# Altium schematic sheet Moto Power Supply 4x12v 4x5v.SchDoc: ComponentName
size A4; SheetNumber: 1; SheetTotal: 1; Version: ver; Variant: Variant; Modification: Mod; Project: Project Name
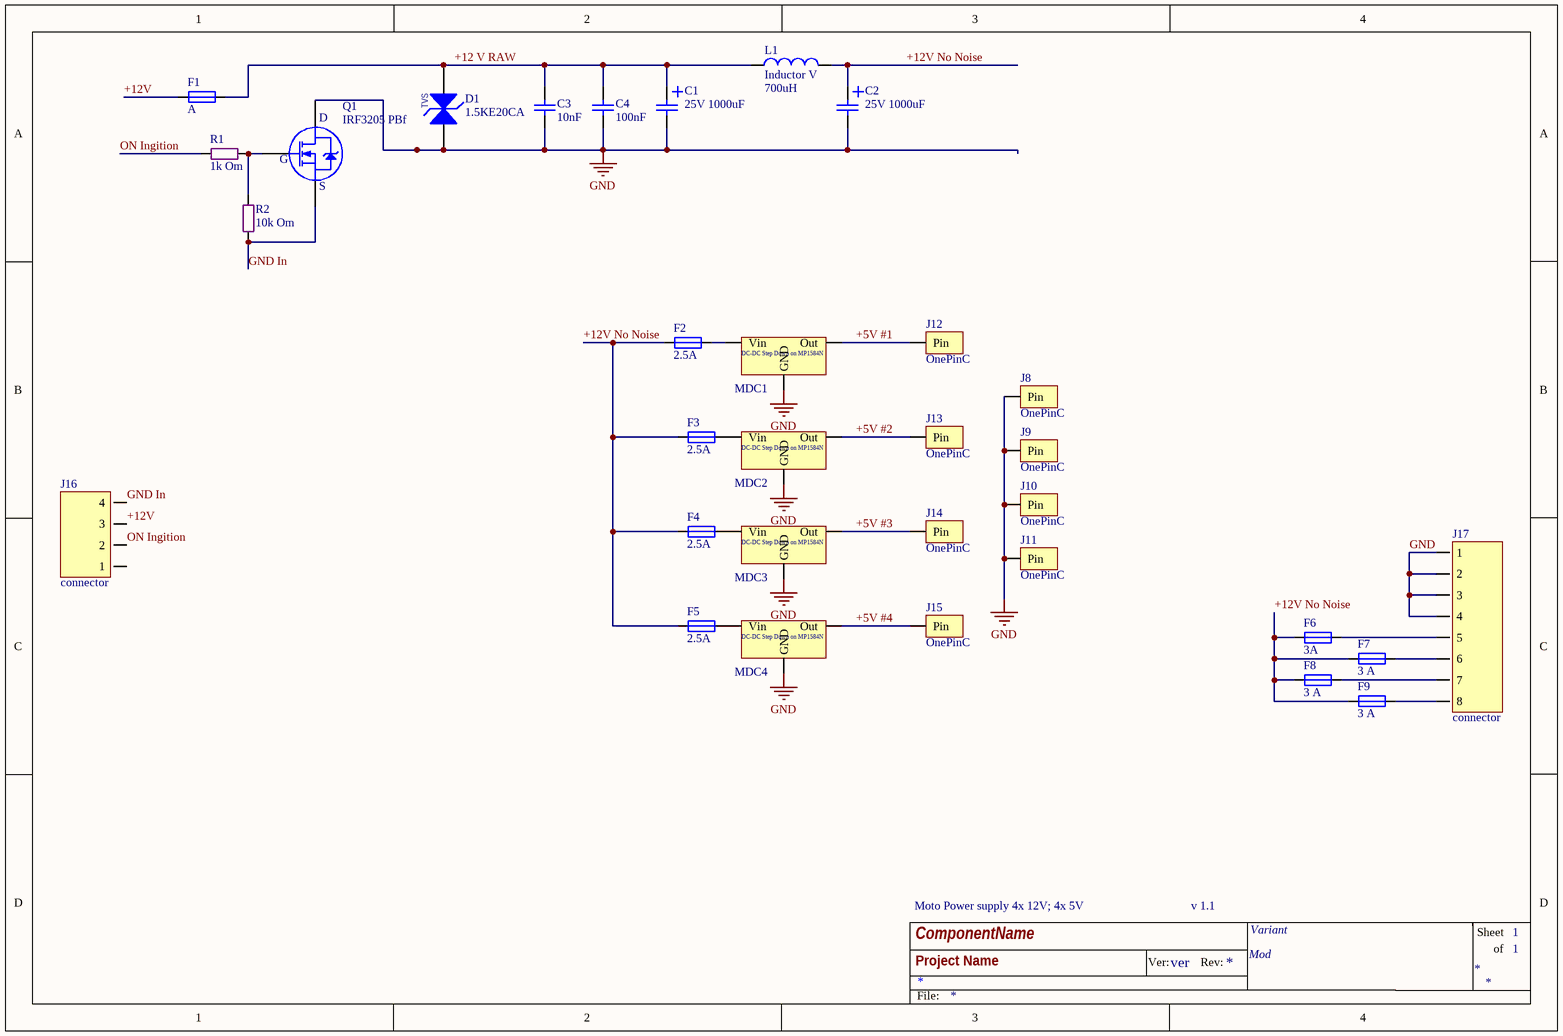
[diagram p0: Moto Power Supply 4x12v 4x5v.SchDoc]

## Parts
C1  25V 1000uF  [Cap E p5.08mm D10.2mm (3p)]
C2  25V 1000uF  [Cap E p5.08mm D10.2mm (3p)]
C3  10nF  [SMD 1206 (3216)]
C4  100nF  [SMD 1206 (3216)]
D1  1.5KE20CA  [TVS diode DO-201 V]
F1  A  [Fuse RGE1100]
F2  2.5A  [Fuse SM250]
F3  2.5A  [Fuse SM250]
F4  2.5A  [Fuse SM250]
F5  2.5A  [Fuse SM250]
F6  3A  [Fuse MF-R300 (3A)]
F7  3 A  [Fuse MF-R300 (3A)]
F8  3 A  [Fuse MF-R300 (3A)]
F9  3 A  [Fuse MF-R300 (3A)]
J8  OnePinC  [OnePin 1.2x3]
J9  OnePinC  [OnePin 1.2x3]
J10  OnePinC  [OnePin 1.2x3]
J11  OnePinC  [OnePin 1.2x3]
J12  OnePinC  [OnePin 1.2x3]
J13  OnePinC  [OnePin 1.2x3]
J14  OnePinC  [OnePin 1.2x3]
J15  OnePinC  [OnePin 1.2x3]
J16  connector  [Molex Mini-Fit Jr - 4Pin V]
J17  connector  [Molex Mini-Fit Jr - 8Pin V]
L1  Inductor V  value 700uH  [Toroid V D14-W6]
MDC1  DC-DC  [DC-DC_MP1584N (SMALL R)]  (value not drawn)
MDC2  DC-DC  [DC-DC_MP1584N (SMALL R)]  (value not drawn)
MDC3  DC-DC  [DC-DC_MP1584N (SMALL R)]  (value not drawn)
MDC4  DC-DC  [DC-DC_MP1584N (SMALL R)]  (value not drawn)
Q1  IRF3205 PBf  [TO220-2]
R1  1k Om  [SMD 0805 (2012)]
R2  10k Om  [SMD 0805 (2012)]

## Nets
GND: C1.2 C2.2 C3.2 C4.2 D1.1 J8.1(Pin) J9.1(Pin) J10.1(Pin) J11.1(Pin) J17.1 J17.2 J17.3 J17.4 MDC1.GND MDC2.GND MDC3.GND MDC4.GND Q1.2(D)
+5V #1: J12.1(Pin) MDC1.OUT(Out)
+5V #2: J13.1(Pin) MDC2.OUT(Out)
+5V #3: J14.1(Pin) MDC3.OUT(Out)
+5V #4: J15.1(Pin) MDC4.OUT(Out)
+12 V RAW: C1.1 C3.1 C4.1 D1.2 F1.2 L1.1
+12V: F1.1 J16.3
+12V No Noise: C2.1 F2.1 F3.1 F4.1 F5.1 F6.2 F7.2 F8.2 F9.2 L1.2
GND In: J16.4 Q1.3(S) R2.1
ON Ingition: J16.2 R1.1
NetF2_2: F2.2 MDC1.IN(Vin)
NetF3_2: F3.2 MDC2.IN(Vin)
NetF4_2: F4.2 MDC3.IN(Vin)
NetF5_2: F5.2 MDC4.IN(Vin)
NetF6_1: F6.1 J17.5
NetF7_1: F7.1 J17.6
NetF8_1: F8.1 J17.7
NetF9_1: F9.1 J17.8
NetQ1_1: Q1.1(G) R1.2 R2.2

Not connected (* = marked no-connect by the designer): J16 1

## Notes on the sheet
- Moto Power supply 4x 12V; 4x 5V
- v 1.1
- Ver:
- Rev:
- Sheet
- of
- File:
- (in symbol DC-DC MP1584N) DC-DC Step Down on MP1584N
- (in symbol TVS 1.5KE20CA) TVS

## Library data of the parts
C1 C2 = Cap E 1000mF x 25V: Capacitor
C3 C4 = Cap Ceramic SMD (All): Capacitor
D1 = TVS 1.5KE20CA: 1500W Transil (TVS Diode); Stand-Off V: 17.1; Load A: 5; Breakdown V: min 19 max 21; PackageReference: DO-201; Pulse Power: 1500W; VALUE: 1.5KE20CA
F1-F9 = Fuse: Round fuse
J8-J15 = OnePin Connector: Only pad
J16 = Molex Mini-Fit Jr - 4 pin: Right, Dbl line, Female
J17 = Molex Mini-Fit Jr - 8 pin: Right, Dbl line, Female
L1 = Inductor V: Inductor Vertical; Code_IEC: 1005; Published: 8-Jun-2000; LatestRevisionDate: 29-May-2009; LatestRevisionNote: IPC-7351 Footprint Added.; PackageReference: 0402-A; Publisher: Altium Limited; PackageDescription: Chip Inductor; Code_JEITA: 0402
MDC1-MDC4 = DC-DC MP1584N: DC-DC StepDown
Q1 = IRF3205: N-Channel 55V - 0.008Ω - 110A; Monufacturer: IOR; RDS Сопротивление Сток-Исток: 0.008 Om; I d - Drain current (continuous) at TC = 100°C: 80 A; VGS Порог Открытия: +2....+4 V; VGS Макс напр на гейте: +-20 V; C ISS Входная емкость: 3247 pF; C OSS Выходная емкость: 781 pF; V DSS (v): 55V; I d - Drain current (continuous) at TC = 25°C: 110 A; Name: IRF3205 PBf; Datasheet: http://tec.org.ru/_bd/2/223_IRF3205.pdf; URL: http://tec.org.ru/board/49-1-0-223
R1 R2 = Res All Types